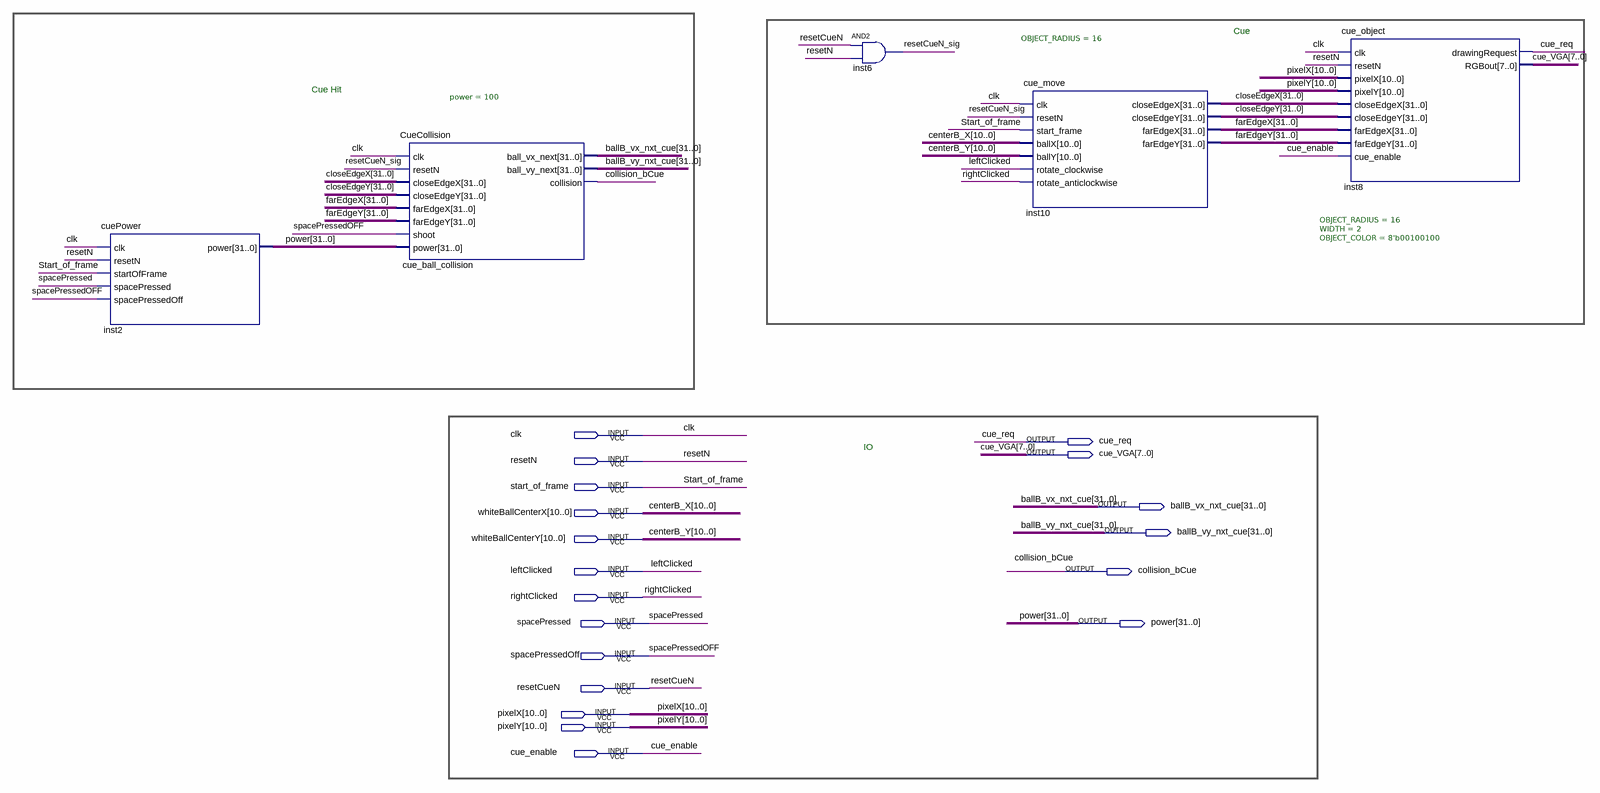
[diagram p0: schematic sheet]
// Quartus schematic CUE_TOP.bdf as structural Verilog: 5 symbols, 19 pins
module CUE_TOP (
  input  clk,
  input  resetN,
  input  start_of_frame,
  input  [10:0] whiteBallCenterX,
  input  [10:0] whiteBallCenterY,
  input  leftClicked,
  input  rightClicked,
  input  spacePressed,
  input  spacePressedOff,
  input  resetCueN,
  input  [10:0] pixelX,
  input  [10:0] pixelY,
  input  cue_enable,
  output cue_req,
  output [7:0] cue_VGA,
  output [31:0] ballB_vx_nxt_cue,
  output [31:0] ballB_vy_nxt_cue,
  output collision_bCue,
  output [31:0] power
);

  wire resetCueN_sig;
  wire [31:0] closeEdgeX, closeEdgeY, farEdgeX, farEdgeY;

  cuePower inst2 (
    .clk(clk), .resetN(resetN), .startOfFrame(start_of_frame), .spacePressed(spacePressed),
    .spacePressedOff(spacePressedOff), .power(power));
  CueCollision #(.power(100)) cue_ball_collision (
    .clk(clk), .resetN(resetCueN_sig), .closeEdgeX(closeEdgeX), .closeEdgeY(closeEdgeY), .farEdgeX(farEdgeX),
    .farEdgeY(farEdgeY), .shoot(spacePressedOff), .power(power), .ball_vx_next(ballB_vx_nxt_cue),
    .ball_vy_next(ballB_vy_nxt_cue), .collision(collision_bCue));
  and inst6 (resetCueN_sig, resetCueN, resetN);
  cue_move #(.OBJECT_RADIUS(16)) inst10 (
    .clk(clk), .resetN(resetCueN_sig), .start_frame(start_of_frame), .ballX(whiteBallCenterX),
    .ballY(whiteBallCenterY), .rotate_clockwise(leftClicked), .rotate_anticlockwise(rightClicked),
    .closeEdgeX(closeEdgeX), .closeEdgeY(closeEdgeY), .farEdgeX(farEdgeX), .farEdgeY(farEdgeY));
  cue_object #(.OBJECT_RADIUS(16), .WIDTH(2), .OBJECT_COLOR(8'b00100100)) inst8 (
    .clk(clk), .resetN(resetN), .pixelX(pixelX), .pixelY(pixelY), .closeEdgeX(closeEdgeX),
    .closeEdgeY(closeEdgeY), .farEdgeX(farEdgeX), .farEdgeY(farEdgeY), .cue_enable(cue_enable),
    .drawingRequest(cue_req), .RGBout(cue_VGA));

  // Other names for the same wires on the sheet: centerB_X[10:0] = whiteBallCenterX;
  //   centerB_Y[10:0] = whiteBallCenterY

  // Notes on the sheet:
  //   Cue
  //   Cue Hit
  //   IO
endmodule
